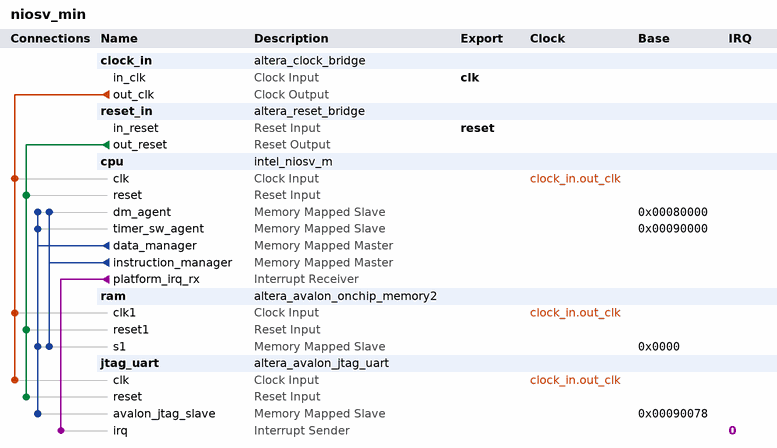
[diagram p0: system contents]
# Platform Designer (Qsys) system niosv_min, Cyclone 10 LP 10CL025YU256C8G
# Parameters at their usual value, and those the tool derives, are not listed.
package require -exact qsys 22.1
create_system niosv_min
set_project_property DEVICE_FAMILY {Cyclone 10 LP}
set_project_property DEVICE 10CL025YU256C8G

add_instance clock_in altera_clock_bridge 22.1
set_instance_parameter_value clock_in DERIVED_CLOCK_RATE 0
set_instance_parameter_value clock_in EXPLICIT_CLOCK_RATE 50000000

add_instance reset_in altera_reset_bridge 22.1
set_instance_parameter_value reset_in ACTIVE_LOW_RESET 0
set_instance_parameter_value reset_in SYNCHRONOUS_EDGES none

add_instance cpu intel_niosv_m 1.0.0
set_instance_parameter_value cpu enableDebugReset false
set_instance_parameter_value cpu resetSlave ram.s1

add_instance ram altera_avalon_onchip_memory2 22.1
set_instance_parameter_value ram dataWidth 32
set_instance_parameter_value ram dualPort false
set_instance_parameter_value ram initMemContent true
set_instance_parameter_value ram initializationFileName niosv_min_ram.hex
set_instance_parameter_value ram memorySize 32768
set_instance_parameter_value ram useNonDefaultInitFile true

add_instance jtag_uart altera_avalon_jtag_uart 22.1
set_instance_parameter_value jtag_uart simInteractiveOptions NO_INTERACTIVE_WINDOWS

# connections
add_connection clock_in.out_clk cpu.clk clock
add_connection clock_in.out_clk jtag_uart.clk clock
add_connection clock_in.out_clk ram.clk1 clock
add_connection reset_in.out_reset cpu.reset reset
add_connection reset_in.out_reset jtag_uart.reset reset
add_connection reset_in.out_reset ram.reset1 reset
add_connection cpu.data_manager cpu.dm_agent avalon
set_connection_parameter_value cpu.data_manager/cpu.dm_agent baseAddress 0x00080000
add_connection cpu.data_manager cpu.timer_sw_agent avalon
set_connection_parameter_value cpu.data_manager/cpu.timer_sw_agent baseAddress 0x00090000
add_connection cpu.data_manager jtag_uart.avalon_jtag_slave avalon
set_connection_parameter_value cpu.data_manager/jtag_uart.avalon_jtag_slave baseAddress 0x00090078
add_connection cpu.data_manager ram.s1 avalon
set_connection_parameter_value cpu.data_manager/ram.s1 baseAddress 0x0000
add_connection cpu.instruction_manager cpu.dm_agent avalon
set_connection_parameter_value cpu.instruction_manager/cpu.dm_agent baseAddress 0x00080000
add_connection cpu.instruction_manager ram.s1 avalon
set_connection_parameter_value cpu.instruction_manager/ram.s1 baseAddress 0x0000
add_connection cpu.platform_irq_rx jtag_uart.irq interrupt
set_connection_parameter_value cpu.platform_irq_rx/jtag_uart.irq irqNumber 0

# exported interfaces
add_interface clk clock sink
set_interface_property clk EXPORT_OF clock_in.in_clk
add_interface reset reset sink
set_interface_property reset EXPORT_OF reset_in.in_reset

set_interconnect_requirement {$system} qsys_mm.clockCrossingAdapter HANDSHAKE
set_interconnect_requirement {$system} qsys_mm.enableEccProtection FALSE
set_interconnect_requirement {$system} qsys_mm.insertDefaultSlave FALSE
set_interconnect_requirement {$system} qsys_mm.maxAdditionalLatency 1

save_system niosv_min.qsys
